# Altium schematic sheet [04] - OLD_Display & Pi Zero & USB Host.SchDoc
size A3; DocumentNumber: 2; SheetNumber: 2; SheetTotal: 4
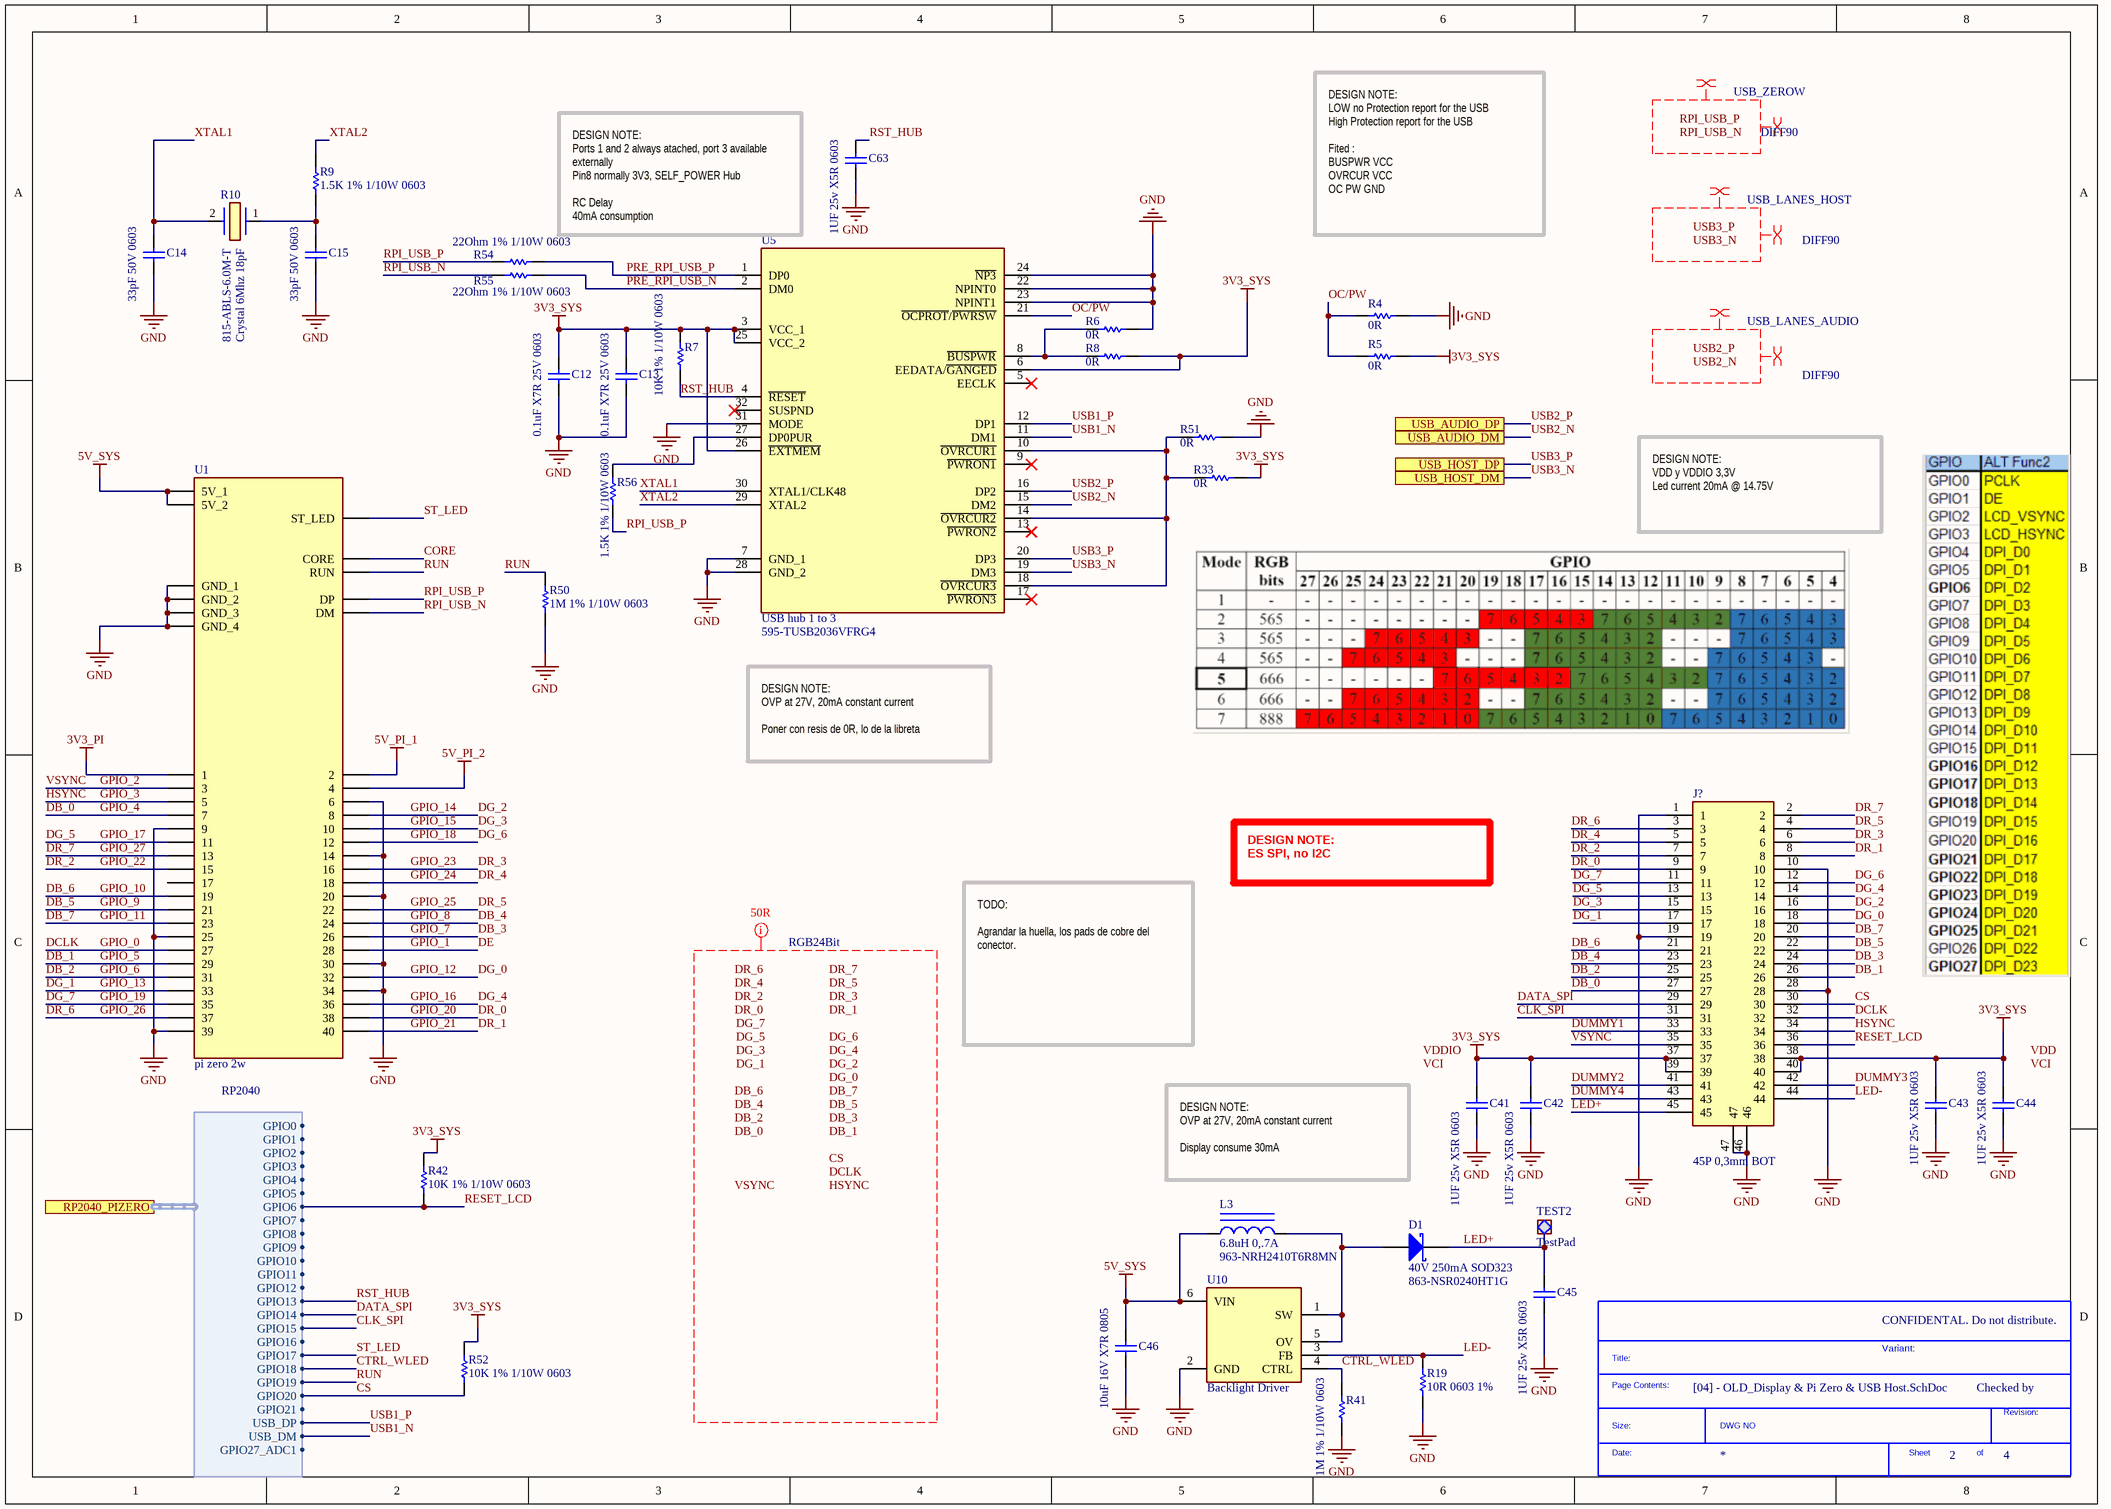
[diagram p0: [04] - OLD_Display & Pi Zero & USB Host.SchDoc]

## Parts
*  SDTitleBlock  (value not drawn)  (graphical)
C12  0.1uF X7R 25V 0603  [C 0603/1608]
C13  0.1uF X7R 25V 0603  [C 0603/1608]
C14  33pF 50V 0603  [C 0603/1608]
C15  33pF 50V 0603  [C 0603/1608]
C41  1UF 25v X5R 0603  [C 0603/1608]
C42  1UF 25v X5R 0603  [C 0603/1608]
C43  1UF 25v X5R 0603  [C 0603/1608]
C44  1UF 25v X5R 0603  [C 0603/1608]
C45  1UF 25v X5R 0603  [C 0603/1608]
C46  10uF 16V X7R 0805  [C 0805/2012]
C63  1UF 25v X5R 0603  [C 0603/1608]
D1  40V 250mA SOD323  Supplier Part Number 1: 863-NSR0240HT1G  [SOD-323]
J?  45P 0,3mm BOT  [FH26W45S03SHW60]
L3  6.8uH 0,.7A  Supplier Part Number 1: 963-NRH2410T6R8MN  [NRH2410T6R8MN]
R4  0R  [R 0603/1608]
R5  0R  [R 0603/1608]  (no BOM)
R6  0R  [R 0603/1608]  (no BOM)
R7  10K 1% 1/10W 0603  [R 0603/1608]
R8  0R  [R 0603/1608]
R9  1.5K 1% 1/10W 0603  [R 0603/1608]
R10  Crystal 6Mhz 18pF  Supplier Part Number 1: 815-ABLS-6.0M-T  [ABLS6000MHZB4T]
R19  10R 0603 1%  [R 0603/1608]
R33  0R  [R 0603/1608]
R41  1M 1% 1/10W 0603  [R 0603/1608]
R42  10K 1% 1/10W 0603  [R 0603/1608]
R50  1M 1% 1/10W 0603  [R 0603/1608]
R51  0R  [R 0603/1608]
R52  10K 1% 1/10W 0603  [R 0603/1608]
R54  22Ohm 1% 1/10W 0603  [R 0603/1608]
R55  22Ohm 1% 1/10W 0603  [R 0603/1608]
R56  1.5K 1% 1/10W 0603  [R 0603/1608]
TEST2  TestPad  [TestPad]  (no BOM)
U1  pi zero 2w  [Pi 2 Zero W]
U5  USB hub 1 to 3  Supplier Part Number 1: 595-TUSB2036VFRG4  [QFP80P900X900X160-32N]
U10  Backlight Driver  [SOT95P280X145-6N]

## Ports
RP2040_PIZERO (harness RP2040), USB_AUDIO_DM, USB_AUDIO_DP, USB_HOST_DM, USB_HOST_DP

## Harnesses
RP2040: GPIO0, GPIO1, GPIO2, GPIO3, USB_DP, USB_DM, GPIO27_ADC1, GPIO4, GPIO5, GPIO6, GPIO7, GPIO8, GPIO9, GPIO10, GPIO11, GPIO12, GPIO13, GPIO14, GPIO15, GPIO16, GPIO17, GPIO18, GPIO19, GPIO20, GPIO21

## Nets
3V3_PI: U1.1
3V3_SYS: C12.1 C13.1 C41.1 C42.1 C43.1 C44.1 J?.37 J?.38 J?.39 J?.40 R5.2 R7.2 R8.1 R33.1 R42.2 R52.2 U5.3(VCC_1) U5.6(EEDATA/~{GANGED}) U5.25(VCC_2) U5.26(~{EXTMEM})
5V_PI_1: U1.2
5V_PI_2: U1.4
5V_SYS: C46.2 L3.1 U1.5V_1 U1.5V_2 U10.6(VIN)
GND: C12.2 C13.2 C14.1 C15.2 C41.2 C42.2 C43.2 C44.2 C45.2 C46.1 C63.2 J?.1 J?.10 J?.19 J?.28 J?.46 J?.47 R4.2 R6.2 R19.1 R41.1 R50.1 R51.1 U1.6 U1.9 U1.14 U1.20 U1.25 U1.30 U1.34 U1.39 U1.GND_1 U1.GND_2 U1.GND_3 U1.GND_4 U5.7(GND_1) U5.22(NPINT0) U5.23(NPINT1) U5.24(~{NP3}) U5.28(GND_2) U5.31(MODE) U10.2(GND)
CLK_SPI: J?.31 ; port RP2040_PIZERO.GPIO15
CORE: U1.CORE
CS: J?.30 R52.1 ; port RP2040_PIZERO.GPIO20
CTRL_WLED: R41.2 U10.4(CTRL) ; port RP2040_PIZERO.GPIO18
DATA_SPI: J?.29 ; port RP2040_PIZERO.GPIO14
DB_0: J?.27 U1.7  [also labelled GPIO_4]
DB_1: J?.26 U1.29  [also labelled GPIO_5]
DB_2: J?.25 U1.31  [also labelled GPIO_6]
DB_3: J?.24 U1.26  [also labelled GPIO_7]
DB_4: J?.23 U1.24  [also labelled GPIO_8]
DB_5: J?.22 U1.21  [also labelled GPIO_9]
DB_6: J?.21 U1.19  [also labelled GPIO_10]
DB_7: J?.20 U1.23  [also labelled GPIO_11]
DCLK: J?.32 U1.27  [also labelled GPIO_0]
DE: U1.28  [also labelled GPIO_1]
DG_0: J?.18 U1.32  [also labelled GPIO_12]
DG_1: J?.17 U1.33  [also labelled GPIO_13]
DG_2: J?.16 U1.8  [also labelled GPIO_14]
DG_3: J?.15 U1.10  [also labelled GPIO_15]
DG_4: J?.14 U1.36  [also labelled GPIO_16]
DG_5: J?.13 U1.11  [also labelled GPIO_17]
DG_6: J?.12 U1.12  [also labelled GPIO_18]
DG_7: J?.11 U1.35  [also labelled GPIO_19]
DR_0: J?.9 U1.38  [also labelled GPIO_20]
DR_1: J?.8 U1.40  [also labelled GPIO_21]
DR_2: J?.7 U1.15  [also labelled GPIO_22]
DR_3: J?.6 U1.16  [also labelled GPIO_23]
DR_4: J?.5 U1.18  [also labelled GPIO_24]
DR_5: J?.4 U1.22  [also labelled GPIO_25]
DR_6: J?.3 U1.37  [also labelled GPIO_26]
DR_7: J?.2 U1.13  [also labelled GPIO_27]
DUMMY1: J?.33
DUMMY2: J?.41
DUMMY3: J?.42
DUMMY4: J?.43
GPIO_2: J?.35 U1.3  [also labelled VSYNC]
GPIO_3: J?.34 U1.5  [also labelled HSYNC]
LED+: C45.1 D1.1(K) J?.45 TEST2.1
LED-: J?.44 R19.2 U10.3(FB)
OC/PW: R4.1 R5.1 U5.21(~{OCPROT}/~{PWRSW})
PRE_RPI_USB_N: R55.2 U5.2(DM0)
PRE_RPI_USB_P: R54.2 U5.1(DP0)
RESET_LCD: J?.36 R42.1 ; port RP2040_PIZERO.GPIO6
RPI_USB_N: R55.1 U1.DM
RPI_USB_P: R54.1 R56.2 U1.DP
RST_HUB: C63.1 R7.1 U5.4(~{RESET}) ; port RP2040_PIZERO.GPIO13
RUN: R50.2 U1.RUN ; port RP2040_PIZERO.GPIO19
ST_LED: U1.ST_LED ; port RP2040_PIZERO.GPIO17
USB1_N: U5.11(DM1) ; port RP2040_PIZERO.USB_DM
USB1_P: U5.12(DP1) ; port RP2040_PIZERO.USB_DP
USB2_N: U5.15(DM2) ; port USB_AUDIO_DM
USB2_P: U5.16(DP2) ; port USB_AUDIO_DP
USB3_N: U5.19(DM3) ; port USB_HOST_DM
USB3_P: U5.20(DP3) ; port USB_HOST_DP
XTAL1: C14.2 R10.2(CRYSTAL_2) U5.30(XTAL1/CLK48)
XTAL2: R9.2 U5.29(XTAL2)
NetC15_1: C15.1 R9.1 R10.1
NetD1_2: D1.2(A) L3.2 U10.1(SW) U10.5(OV)
NetR6_1: R6.1 R8.2 U5.8(~{BUSPWR})
NetR33_2: R33.2 R51.2 U5.10(~{OVRCUR1}) U5.14(~{OVRCUR2}) U5.18(~{OVRCUR3})
NetR56_1: R56.1 U5.27(DP0PUR)

Not connected (* = marked no-connect by the designer): U1 17; U5 5(EECLK)* 9(~{PWRON1})* 13(~{PWRON2})* 17(~{PWRON3})* 32(SUSPND)*

## Layout directives
net class USB_LANES_HOST; rule Differential Pairs Routing [Pref Gap = 0.18mm    Min Gap  = 0.18mm    Max Gap  = 0.18mmPref Width = 0.15mm    Min Width  = 0.15mm    Max Width  = 0.15mm]: USB3_N, USB3_P
net class USB_LANES_AUDIO; rule Differential Pairs Routing [Pref Gap = 0.18mm    Min Gap  = 0.18mm    Max Gap  = 0.18mmPref Width = 0.15mm    Min Width  = 0.15mm    Max Width  = 0.15mm]: USB2_N, USB2_P
net class USB_ZEROW; rule Differential Pairs Routing [Pref Gap = 0.18mm    Min Gap  = 0.18mm    Max Gap  = 0.18mmPref Width = 0.15mm    Min Width  = 0.15mm    Max Width  = 0.15mm]: RPI_USB_N, RPI_USB_P
differential pair; net class DIFF90: RPI_USB_N, RPI_USB_P, USB2_N, USB2_P, USB3_N, USB3_P
net class RGB24Bit; rule Width Constraint [Pref Width = 0.18mm    Min Width = 0.18mm    Max Width = 0.18mm]: CS, DB_0, DB_1, DB_2, DB_3, DB_4, DB_5, DB_6, DB_7, DCLK, DG_0, DG_1, DG_2, DG_3, DG_4, DG_5, DG_6, DG_7, DR_0, DR_1, DR_2, DR_3, DR_4, DR_5, DR_6, DR_7, HSYNC, VSYNC

## Notes on the sheet
- DESIGN NOTE:
  Ports 1 and 2 always atached, port 3 available externally
  Pin8 normally 3V3, SELF_POWER Hub
  RC Delay
  40mA consumption
- DESIGN NOTE:
  LOW no Protection report for the USB
  High Protection report for the USB
  Fited :
  BUSPWR VCC
  OVRCUR VCC
  OC PW GND
- DESIGN NOTE:
  VDD y VDDIO 3,3V
  Led current 20mA @ 14.75V
- DESIGN NOTE:
  OVP at 27V, 20mA constant current
  Poner con resis de 0R, lo de la libreta
- DESIGN NOTE:
  ES SPI, no I2C
- TODO:
  Agrandar la huella, los pads de cobre del conector.
- DESIGN NOTE:
  OVP at 27V, 20mA constant current
  Display consume 30mA
- CONFIDENTAL. Do not distribute.
- Variant:
- Checked by
- Labels drawn without touching a wire or pin: CS, DB_0, DB_1, DB_2, DB_3, DB_4, DB_5, DB_6, DB_7, DCLK, DG_0, DG_1, DG_2, DG_3, DG_4, DG_5, DG_6, DG_7, DR_0, DR_1, DR_2, DR_3, DR_4, DR_5, DR_6, DR_7, HSYNC, RPI_USB_N, RPI_USB_P, USB2_N, USB2_P, USB3_N, USB3_P, VCI, VDD, VDDIO, VSYNC
- (in symbol SDTitleBlock) Title:; Page Contents:; Revision:; Size:; DWG NO; Date:; Sheet; of

## Library data of the parts
C12 C13 = 885012206071: WURTH ELEKTRONIK         885012206071             SMD Multilayer Ceramic Capacitor, 0603 [1608 Metric], 0.1 F, 25 V,  10%, X7R, WCAP-CSGP Series; Manufacturer: Wurth Electronics; Capacitance: 100nF; Supplier 1: Mouser; Manufacturer Part Number: 885012206071; Stock 1: 202580; Pricing 1: 1=0.1, 10=0.046, 50=0.046, 100=0.041, 1000=0.036, 10000=0.036 (USD); Mount: Surface Mount; Case/Package: 0603; Case Code (Metric): 1608; Case Code (Imperial): 0603; Min Operating Temperature: -55°C; Max Operating Temperature: 125°C; Packaging: Cut Tape; Voltage Rating: 25V; Dielectric: X7R; Tolerance: 10%; Voltage Rating (DC): 25V; Length: 0.063inch; Width: 0.031inch; Thickness: 0.037inch; REACH SVHC: Unknown; Supplier Part Number 1: 710-885012206071
C14 C15 = CC0603JRNPO9BN330: 0603 33 pF 50 V ±5 % Tolerance NP0 SMT Multilayer Ceramic Capacitor; Manufacturer: Yageo; Tolerance: 5%; Dielectric: C0G; Temperature Coefficient: 30ppm/°C; Insulation Resistance: 100GR; Supplier 1: Mouser; Manufacturer Part Number: CC0603JRNPO9BN330; RoHS: Yes; Category: Ceramic Capacitors; Stock 1: 62339; Pricing 1: 1=0,10000, 10=0,02400, 50=0,02400, 100=0,01900, 500=0,01700, 1000=0,01300, 4000=0,01000, 10000=0,01000 (USD); Mount: Surface Mount; Case/Package: 0603; Number of Pins: 2; Case Code (Metric): 1608; Case Code (Imperial): 0603; Dielectric Material: Ceramic; Min Operating Temperature: -55°C; Max Operating Temperature: 125°C; Capacitance: 33pF; Packaging: Tape and Reel; Voltage Rating: 50V; Package Quantity: 1; Voltage Rating (DC): 50V; Termination: SMD/SMT; Resistor Type: Ceramic; Voltage: 50V; Series: CC; Length: 1.6mm; Width: 0.031inch; Height: 0.8mm; Thickness: 0.035inch; Depth: 0.8mm; Radiation Hardening: No; REACH SVHC: No SVHC; Lead Free: Lead Free; RoHS Compliant: Yes; ComponentLink1URL: https://datasheet.ciiva.com/11786/0900766b8079c870-11786082.pdf?src-supplier=RSComponents; ComponentLink1Description: https://datasheet.ciiva.com/11786/0900766b8079c870-11786082.pdf?src-supplier=RSComponents; ComponentLink2URL: https://datasheet.ciiva.com/26862/getdatasheetpartid-403532-26862767.pdf?src-supplier=Verical; ComponentLink2Description: https://datasheet.ciiva.com/26862/getdatasheetpartid-403532-26862767.pdf?src-supplier=Verical; ComponentLink3URL: https://datasheet.ciiva.com/8033/1443161-8033735.pdf?src-supplier=Element14; ComponentLink3Description: https://datasheet.ciiva.com/8033/1443161-8033735.pdf?src-supplier=Element14; ComponentLink4URL: https://datasheet.ciiva.com/7978/1443161-7978142.pdf?src-supplier=Element14; ComponentLink4Description: https://datasheet.ciiva.com/7978/1443161-7978142.pdf?src-supplier=Element14; ComponentLink5URL: https://datasheet.ciiva.com/46430/1835847-46430155.pdf?src-supplier=Element14; ComponentLink5Description: https://datasheet.ciiva.com/46430/1835847-46430155.pdf?src-supplier=Element14; ComponentLink6URL: https://datasheet.ciiva.com/144/mlccorderingcode-144644.pdf?src-supplier=Digi-Key; ComponentLink6Description: https://datasheet.ciiva.com/144/mlccorderingcode-144644.pdf?src-supplier=Digi-Key; ComponentLink7URL: https://datasheet.ciiva.com/144/mlccorderingcode-144643.pdf?src-supplier=Digi-Key; ComponentLink7Description: https://datasheet.ciiva.com/144/mlccorderingcode-144643.pdf?src-supplier=Digi-Key; ComponentLink8URL: https://datasheet.ciiva.com/144/mlccorderingcode-144645.pdf?src-supplier=Digi-Key; ComponentLink8Description: https://datasheet.ciiva.com/144/mlccorderingcode-144645.pdf?src-supplier=Digi-Key; ComponentLink9URL: https://datasheet.ciiva.com/5426/upy-gp-np0-16v-to-50v-8-5426614.pdf?src-supplier=Mouser; ComponentLink9Description: https://datasheet.ciiva.com/5426/upy-gp-np0-16v-to-50v-8-5426614.pdf?src-supplier=Mouser; ComponentLink10URL: https://datasheet.ciiva.com/8033/1372269-8033734.pdf?src-supplier=Element14; ComponentLink10Description: https://datasheet.ciiva.com/8033/1372269-8033734.pdf?src-supplier=Element14; ComponentLink11URL: https://datasheet.ciiva.com/11464/upy-gp-np0-16v-to-50v-8-11464730.pdf?src-supplier=Avnet; ComponentLink11Description: https://datasheet.ciiva.com/11464/upy-gp-np0-16v-to-50v-8-11464730.pdf?src-supplier=Avnet; Supplier Part Number 1: 603-C0603JRNPO9BN330
C41-C45 C63 = CC0603KRX5R8BB105: CAP CER 1UF 25V X5R 0603; Manufacturer: Yageo; Tolerance: 10%; Supplier 1: Mouser; Manufacturer Part Number: CC0603KRX5R8BB105; RoHS: Yes; Stock 1: 9567246; Pricing 1: 1 = 0,10000, 10 = 0,04700, 50 = 0,04700, 100 = 0,01700, 1000 = 0,01600, 10000 = 0,00800 (USD); Mount: Surface Mount; Case/Package: 0603; Number of Pins: 2; Case Code (Metric): 1608; Case Code (Imperial): 0603; Min Operating Temperature: -55°C; Max Operating Temperature: 85°C; Package Quantity: 1; Capacitance: 1uF; Voltage Rating: 25V; Packaging: Tape and Reel; Dielectric: X5R; Termination: SMD/SMT; Voltage Rating (DC): 25V; Length: 1.6mm; Height: 0.8mm; Width: 0.031inch; Thickness: 0.035inch; Depth: 0.8mm; Radiation Hardening: No; REACH SVHC: No SVHC; Lead Free: Lead Free; Halogen Free: Halogen Free; ComponentLink1URL: https://datasheet.ciiva.com/176/mlccorderingcode-176785.pdf?src-supplier=Digi-Key; ComponentLink1Description: https://datasheet.ciiva.com/176/mlccorderingcode-176785.pdf?src-supplier=Digi-Key; ComponentLink2URL: https://datasheet.ciiva.com/176/mlccorderingcode-176786.pdf?src-supplier=Digi-Key; ComponentLink2Description: https://datasheet.ciiva.com/176/mlccorderingcode-176786.pdf?src-supplier=Digi-Key; ComponentLink3URL: https://datasheet.ciiva.com/176/mlccorderingcode-176787.pdf?src-supplier=Digi-Key; ComponentLink3Description: https://datasheet.ciiva.com/176/mlccorderingcode-176787.pdf?src-supplier=Digi-Key; ComponentLink4URL: https://datasheet.ciiva.com/17436/upy-gphc-x5r-4v-to-50v-12-17436952.pdf?src-supplier=Avnet+Europe; ComponentLink4Description: https://datasheet.ciiva.com/17436/upy-gphc-x5r-4v-to-50v-12-17436952.pdf?src-supplier=Avnet+Europe; ComponentLink5URL: https://datasheet.ciiva.com/7978/1525783-7978171.pdf?src-supplier=Element14; ComponentLink5Description: https://datasheet.ciiva.com/7978/1525783-7978171.pdf?src-supplier=Element14; ComponentLink6URL: https://datasheet.ciiva.com/11586/upy-gphc-x5r-4v-to-50v-12-11586318.pdf?src-supplier=Avnet; ComponentLink6Description: https://datasheet.ciiva.com/11586/upy-gphc-x5r-4v-to-50v-12-11586318.pdf?src-supplier=Avnet; Supplier Part Number 1: 603-CC603KRX5R8BB105
C46 = CL21B106KOQNNNE: CAP CER 10UF 16V X7R 0805; Manufacturer: Samsung Electro-Mechanics; Tolerance: ±10%; Notification: Current market demand for these product types have resulted in fluctuating and extending lead times. Lead times may differ.; Supplier 1: Digi-Key; Manufacturer Part Number: CL21B106KOQNNNE; RoHS: RoHS Compliant; Category: Capacitors; Stock 1: 20000; Pricing 1: 1=0.24, 10=0.163, 100=0.0923, 500=0.06514, 1000=0.057 (GBP); Packaging: Cut Tape (CT); Part Status: Active; Voltage - Rated: 16V; Temperature Coefficient: X7R; Operating Temperature: -55°C ~ 125°C; Features: -; Ratings: -; Applications: General Purpose; Mounting Type: Surface Mount, MLCC; Package / Case: 0805 (2012 Metric); Size / Dimension: 0.079" L x 0.049" W (2.00mm x 1.25mm); Height - Seated (Max): -; Thickness (Max): 0.055" (1.40mm); Lead Spacing: -; Lead Style: -; ComponentLink1URL: http://www.samsungsem.com/kr/support/product-search/mlcc/CL21B106KOQNNNE.jsp; ComponentLink1Description: http://www.samsungsem.com/kr/support/product-search/mlcc/CL21B106KOQNNNE.jsp; Supplier Part Number 1: 1276-2872-1-ND
D1 = NSR0240HT1G: DIODE SCHOTTKY 40V 250MA SOD323; Manufacturer: ON Semiconductor; Max Surge Current: 1A; Recovery Time: 3ns; Peak Reverse Current: 10uA; Forward Voltage: 710mV; Power Dissipation: 270mW; Element Configuration: Single; Supplier 1: Mouser; Manufacturer Part Number: NSR0240HT1G; RoHS: Yes; Stock 1: 30582; Pricing 1: 1 = 0,23000, 10 = 0,15400, 50 = 0,15400, 100 = 0,06500, 1000 = 0,04400, 10000 = 0,03000 (USD); Case/Package: SOD-323-2; Number of Pins: 2; Contact Plating: Tin; Min Operating Temperature: -55°C; Max Operating Temperature: 150°C; Package Quantity: 1; Forward Current: 250mA; Packaging: Tape and Reel; Max Reverse Leakage Current: 10uA; Average Rectified Current: 250mA; Reverse Recovery Time: 3ns; Max Repetitive Reverse Voltage (Vrrm): 40V; Peak Non-Repetitive Surge Current: 1A; Max Forward Surge Current (Ifsm): 1A; Max Reverse Voltage (DC): 40V; Length: 1.8mm; Height: 1mm; Width: 1.35mm; Radiation Hardening: No; REACH SVHC: No SVHC; Lead Free: Lead Free; ComponentLink1URL: https://datasheet.ciiva.com/4714/nsr0240h-d-113658-4714368.pdf?src-supplier=Mouser; ComponentLink1Description: https://datasheet.ciiva.com/4714/nsr0240h-d-113658-4714368.pdf?src-supplier=Mouser; ComponentLink2URL: https://datasheet.ciiva.com/8293/nsr0240h-d-8293840.pdf?src-supplier=Avnet; ComponentLink2Description: https://datasheet.ciiva.com/8293/nsr0240h-d-8293840.pdf?src-supplier=Avnet; ComponentLink3URL: https://datasheet.ciiva.com/25949/nsr0240h-d-25949637.pdf?src-supplier=Avnet+Europe; ComponentLink3Description: https://datasheet.ciiva.com/25949/nsr0240h-d-25949637.pdf?src-supplier=Avnet+Europe; ComponentLink4URL: https://datasheet.ciiva.com/915/nsr0240h-d-915416.pdf?src-supplier=Digi-Key; ComponentLink4Description: https://datasheet.ciiva.com/915/nsr0240h-d-915416.pdf?src-supplier=Digi-Key; ComponentLink5URL: https://datasheet.ciiva.com/915/nsr0240h-d-915417.pdf?src-supplier=Digi-Key; ComponentLink5Description: https://datasheet.ciiva.com/915/nsr0240h-d-915417.pdf?src-supplier=Digi-Key; ComponentLink6URL: https://datasheet.ciiva.com/16396/nsr0240h-d-16396521.pdf?src-supplier=Future+Electronics; ComponentLink6Description: https://datasheet.ciiva.com/16396/nsr0240h-d-16396521.pdf?src-supplier=Future+Electronics; ComponentLink7URL: https://datasheet.ciiva.com/915/nsr0240h-d-915418.pdf?src-supplier=Digi-Key; ComponentLink7Description: https://datasheet.ciiva.com/915/nsr0240h-d-915418.pdf?src-supplier=Digi-Key; ComponentLink8URL: https://datasheet.ciiva.com/7963/nsr0240h-d-7963165.pdf?src-supplier=Element14; ComponentLink8Description: https://datasheet.ciiva.com/7963/nsr0240h-d-7963165.pdf?src-supplier=Element14
J? = FH26W-45S-0.3SHW(60): FFC FPC Connectors Horizontal Mounting Angle Light Brown 0.3 mm - Pitch 45 Positions; Manufacturer: Hirose; Supplier 1: Mouser; Manufacturer Part Number: FH26W-45S-0.3SHW(60); RoHS: Yes; Category: FFC / FPC; Stock 1: 44650; Pricing 1: 1=2,29000, 10=1,92000, 50=1,92000, 100=1,79000, 1000=1,28000, 10000=1,13000 (USD); ComponentLink1URL: http://www.farnell.com/datasheets/2691081.pdf?src-supplier=Farnell; ComponentLink1Description: http://www.farnell.com/datasheets/2691081.pdf?src-supplier=Farnell; ComponentLink2URL: https://www.hirose.com/product/document?clcode=CL0580-2401-1-60&amp;productname=FH26W-13S-0.3SHW(60)&amp;series=FH26&amp;documenttype=Catalog&amp;lang=en&amp;documentid=D49355_en&src-supplier=Digi-Key; ComponentLink2Description: https://www.hirose.com/product/document?clcode=CL0580-2401-1-60&amp;productname=FH26W-13S-0.3SHW(60)&amp;series=FH26&amp;documenttype=Catalog&amp;lang=en&amp;documentid=D49355_en&src-supplier=Digi-Key; ComponentLink3URL: https://www.hirose.com/product/en/download_file/key_name/FH26W-61S-0.3SHW%2860%29/category/Drawing%20(2D)/doc_file_id/43329/?file_category_id=6&item_id=05802418460&is_series=&src-supplier=Digi-Key; ComponentLink3Description: https://www.hirose.com/product/en/download_file/key_name/FH26W-61S-0.3SHW%2860%29/category/Drawing%20(2D)/doc_file_id/43329/?file_category_id=6&item_id=05802418460&is_series=&src-supplier=Digi-Key; ComponentLink4URL: https://www.hirose.com/product/en/download_file/key_name/FH26/category/Catalog/doc_file_id/49355/?file_category_id=4&item_id=298&is_series=1&src-supplier=Digi-Key; ComponentLink4Description: https://www.hirose.com/product/en/download_file/key_name/FH26/category/Catalog/doc_file_id/49355/?file_category_id=4&item_id=298&is_series=1&src-supplier=Digi-Key; Supplier Part Number 1: 798-FH26W45S03SHW60
L3 = NRH2410T6R8MN: Inductor Power Shielded Wirewound 6.8uH 20% 100KHz Ferrite 0.57A 0.492Ohm DCR T/R; Manufacturer: Taiyo Yuden; Current Rating: 570mA; Saturation Current: 750mA; Self Resonant Frequency: 43MHz; DC Resistance (DCR): 492mR; Supplier 1: Mouser; Manufacturer Part Number: NRH2410T6R8MN; RoHS: Yes; Category: Fixed Inductors; Stock 1: 34335; Pricing 1: 1=0,23000, 10=0,15400, 50=0,15400, 100=0,12400, 1000=0,09100, 10000=0,06800 (USD); Mount: Surface Mount; Case/Package: Nonstandard; Number of Pins: 2; Core Material: Ferrite; Min Operating Temperature: -25°C; Max Operating Temperature: 120°C; Tolerance: 20%; Shielding: Shielded; Packaging: Tape and Reel; Inductance: 6.8uH; Resistor Type: Wirewound; Test Frequency: 100kHz; Package Quantity: 2500; Inductance Tolerance: 20%; Max DC Current: 750mA; Termination: SMD/SMT; Series: NRH; Length: 2.4mm; Width: 0.094inch; Height: 1mm; Height - Seated (Max): 0.039inch; Lead Pitch: 1.45mm; Depth: 2.5mm; Radiation Hardening: No; RoHS Compliant: Yes; REACH SVHC: No SVHC; Halogen Free: Halogen Free; ComponentLink1URL: https://datasheet.ciiva.com/1043/nrh2410t6r8mn-ss-1043809.pdf?src-supplier=Digi-Key; ComponentLink1Description: https://datasheet.ciiva.com/1043/nrh2410t6r8mn-ss-1043809.pdf?src-supplier=Digi-Key; ComponentLink2URL: https://datasheet.ciiva.com/8502/nrh2410t6r8mn-ss-8502817.pdf?src-supplier=Avnet; ComponentLink2Description: https://datasheet.ciiva.com/8502/nrh2410t6r8mn-ss-8502817.pdf?src-supplier=Avnet; ComponentLink3URL: https://datasheet.ciiva.com/25606/0900766b810b3cd2-25606903.pdf?src-supplier=RSComponents; ComponentLink3Description: https://datasheet.ciiva.com/25606/0900766b810b3cd2-25606903.pdf?src-supplier=RSComponents
R4-R6 R8 R33 R51 = RC0603JR-070RL: RES SMD 0 OHM JUMPER 1/10W 0603; Manufacturer: Yageo; Resistance: 0mR; Tolerance: 1%; Power Rating: 100mW; Voltage Rating (DC): 50V; Temperature Coefficient: 200ppm/°C; Supplier 1: Mouser; Manufacturer Part Number: RC0603JR-070RL; RoHS: Yes; Stock 1: 11022274; Pricing 1: 1 = 0,10000, 10 = 0,01500, 50 = 0,01500, 100 = 0,00500, 1000 = 0,00400, 10000 = 0,00400 (USD); Case/Package: 0603; Number of Pins: 2; Contact Plating: Tin; Case Code (Imperial): 0603; Case Code (Metric): 1608; Min Operating Temperature: -55°C; Max Operating Temperature: 155°C; Composition: Thick Film; Packaging: Tape and Reel; Termination: SMD/SMT; Package Quantity: 5000; Voltage Rating: 50V; Military Standard: Not; Length: 1.6mm; Height: 0.45mm; Width: 0.8mm; Depth: 0.8mm; Radiation Hardening: No; REACH SVHC: No SVHC; Lead Free: Lead Free; ComponentLink1URL: https://datasheet.ciiva.com/11808/pyu-r-int-6-11808700.pdf?src-supplier=RSComponents; ComponentLink1Description: https://datasheet.ciiva.com/11808/pyu-r-int-6-11808700.pdf?src-supplier=RSComponents; ComponentLink2URL: https://datasheet.ciiva.com/7746/1738695-7746421.pdf?src-supplier=Element14; ComponentLink2Description: https://datasheet.ciiva.com/7746/1738695-7746421.pdf?src-supplier=Element14; ComponentLink3URL: https://datasheet.ciiva.com/8883/pyu-rc0603-51-rohs-l-4-8883045.pdf?src-supplier=Avnet; ComponentLink3Description: https://datasheet.ciiva.com/8883/pyu-rc0603-51-rohs-l-4-8883045.pdf?src-supplier=Avnet; ComponentLink4URL: https://datasheet.ciiva.com/15189/getdatasheetpartid-329462-15189845.pdf?src-supplier=Verical; ComponentLink4Description: https://datasheet.ciiva.com/15189/getdatasheetpartid-329462-15189845.pdf?src-supplier=Verical; ComponentLink5URL: https://datasheet.ciiva.com/7746/1738695-7746422.pdf?src-supplier=Element14; ComponentLink5Description: https://datasheet.ciiva.com/7746/1738695-7746422.pdf?src-supplier=Element14; ComponentLink6URL: https://datasheet.ciiva.com/12555/rc0603-272842-12555254.pdf?src-supplier=Mouser; ComponentLink6Description: https://datasheet.ciiva.com/12555/rc0603-272842-12555254.pdf?src-supplier=Mouser; ComponentLink7URL: https://datasheet.ciiva.com/22747/443971-22747530.pdf?src-supplier=Element14; ComponentLink7Description: https://datasheet.ciiva.com/22747/443971-22747530.pdf?src-supplier=Element14; Supplier Part Number 1: 603-RC0603JR-070RL
R7 R42 R52 = RC0603FR-0710KL: RES SMD 10K OHM 1% 1/10W 0603; Manufacturer: Yageo; Power (Watts): 0.1W, 1/10W; Temperature Coefficient: ±100ppm/°C; Supplier 1: Digi-Key; Manufacturer Part Number: RC0603FR-0710KL; RoHS: RoHS Compliant; Category: Resistors; Stock 1: 47851285; Pricing 1: 1=0.08, 10=0.013, 100=0.005, 1000=0.00224, 2500=0.00195 (EUR); Packaging: Cut Tape (CT); Part Status: Active; Tolerance: ±1%; Composition: Thick Film; Features: Moisture Resistant; Operating Temperature: -55°C ~ 155°C; Package / Case: 0603 (1608 Metric); Supplier Device Package: 0603; Size / Dimension: 0.063" L x 0.032" W (1.60mm x 0.80mm); Height - Seated (Max): 0.022" (0.55mm); Failure Rate: -; ComponentLink1URL: http://www.yageo.com/documents/recent/PYu-RC_Group_51_RoHS_L_8.pdf; ComponentLink1Description: http://www.yageo.com/documents/recent/PYu-RC_Group_51_RoHS_L_8.pdf; Supplier Part Number 1: 311-10.0KHRCT-ND
R9 R56 = RC0603FR-071K5L: RES SMD 1.5K OHM 1% 1/10W 0603; Manufacturer: Yageo; Resistance: 1.5kR; Temperature Coefficient: 100ppm/°C; Voltage Rating (DC): 50V; Power Rating: 100mW; Supplier 1: Mouser; Manufacturer Part Number: RC0603FR-071K5L; RoHS: Yes; Stock 1: 1280962; Pricing 1: 1 = 0,10000, 10 = 0,01800, 50 = 0,01800, 100 = 0,00600, 1000 = 0,00500, 10000 = 0,00300 (USD); Case/Package: 0603; Number of Pins: 2; Case Code (Metric): 1608; Case Code (Imperial): 0603; Min Operating Temperature: -55°C; Max Operating Temperature: 155°C; Tolerance: 1%; Packaging: Tape and Reel; Composition: Thick Film; Voltage Rating: 50V; Package Quantity: 1; Number of Terminations: 2; Termination: SMD/SMT; Military Standard: Not; Max Power Dissipation: 100mW; Features: Moisture Resistant; Length: 0.063inch; Height: 0.022inch; Width: 0.031inch; Depth: 0.8mm; REACH SVHC: No SVHC; Lead Free: Lead Free; ComponentLink1URL: https://datasheet.ciiva.com/2454/pyu-r-int-thick-7-2454513.pdf?src-supplier=Digi-Key; ComponentLink1Description: https://datasheet.ciiva.com/2454/pyu-r-int-thick-7-2454513.pdf?src-supplier=Digi-Key; ComponentLink2URL: https://datasheet.ciiva.com/2454/pyu-r-int-thick-7-2454514.pdf?src-supplier=Digi-Key; ComponentLink2Description: https://datasheet.ciiva.com/2454/pyu-r-int-thick-7-2454514.pdf?src-supplier=Digi-Key; ComponentLink3URL: https://datasheet.ciiva.com/2454/pyu-r-int-thick-7-2454515.pdf?src-supplier=Digi-Key; ComponentLink3Description: https://datasheet.ciiva.com/2454/pyu-r-int-thick-7-2454515.pdf?src-supplier=Digi-Key; ComponentLink4URL: https://datasheet.ciiva.com/46440/1868787-46440895.pdf?src-supplier=Element14; ComponentLink4Description: https://datasheet.ciiva.com/46440/1868787-46440895.pdf?src-supplier=Element14; Supplier Part Number 1: 603-RC0603FR-071K5L
R10 = ABLS-6.000MHZ-B4-T: Crystal 6MHz ±30ppm (Tol) ±50ppm (Stability) 18pF FUND 100Ohm 2-Pin HC-49/US SMD T/R; Manufacturer: Abracon; ESR (Equivalent Series Resistance): 100R; Supplier 1: Mouser; Manufacturer Part Number: ABLS-6.000MHZ-B4-T; RoHS: Yes; Category: Crystals; Stock 1: 4366; Pricing 1: 1=0,29000, 10=0,23800, 50=0,23800, 100=0,19200, 1000=0,15600, 10000=0,14200 (USD); Mount: Surface Mount; Case/Package: SMD/SMT; Min Operating Temperature: -20°C; Max Operating Temperature: 70°C; Frequency: 6MHz; Load Capacitance: 18pF; Packaging: Tape and Reel; Package Quantity: 1000; Tolerance: 30ppm; Frequency Tolerance: 30ppm; Frequency Stability: 50ppm; Termination: SMD/SMT; Series Resistance: 100R; Length: 11.4mm; Width: 4.7mm; Height: 0.165inch; Depth: 4.7mm; Radiation Hardening: No; REACH SVHC: Yes; Lead Free: Lead Free; ComponentLink1URL: https://datasheet.ciiva.com/15116/getdatasheetpartid-722413-15116851.pdf?src-supplier=Verical; ComponentLink1Description: https://datasheet.ciiva.com/15116/getdatasheetpartid-722413-15116851.pdf?src-supplier=Verical; ComponentLink2URL: https://datasheet.ciiva.com/16378/abls-16378057.pdf?src-supplier=Future+Electronics; ComponentLink2Description: https://datasheet.ciiva.com/16378/abls-16378057.pdf?src-supplier=Future+Electronics; ComponentLink3URL: https://datasheet.ciiva.com/854/abls-854139.pdf?src-supplier=Digi-Key; ComponentLink3Description: https://datasheet.ciiva.com/854/abls-854139.pdf?src-supplier=Digi-Key; ComponentLink4URL: https://datasheet.ciiva.com/854/abls-854140.pdf?src-supplier=Digi-Key; ComponentLink4Description: https://datasheet.ciiva.com/854/abls-854140.pdf?src-supplier=Digi-Key; ComponentLink5URL: https://datasheet.ciiva.com/854/abls-854138.pdf?src-supplier=Digi-Key; ComponentLink5Description: https://datasheet.ciiva.com/854/abls-854138.pdf?src-supplier=Digi-Key; ComponentLink6URL: https://datasheet.ciiva.com/3175/abls-3175436.pdf?src-supplier=Avnet; ComponentLink6Description: https://datasheet.ciiva.com/3175/abls-3175436.pdf?src-supplier=Avnet
R19 = RT0603FRE0710RL: High Precision-High Stability Chip Resistor Thin Film 0603 10Ohm 1% Paper T/R; Manufacturer: Yageo; Power Rating: 100mW; Voltage Rating: 75V; Temperature Coefficient: 50ppm/°C; Supplier 1: Mouser; Manufacturer Part Number: RT0603FRE0710RL; RoHS: Yes; Category: Chip SMD Resistors; Stock 1: 38412; Pricing 1: 1=0,10000, 10=0,06200, 50=0,06200, 100=0,02500, 1000=0,01200, 10000=0,00800 (USD); Case/Package: 0603; Number of Pins: 2; Case Code (Metric): 1608; Case Code (Imperial): 0603; Contact Plating: Tin,Lead; Min Operating Temperature: -55°C; Max Operating Temperature: 125°C; Tolerance: 1%; Resistance: 10R; Packaging: Tape and Reel; Package Quantity: 5000; Resistor Type: Thin Film; Number of Terminations: 2; Termination: SMD/SMT; Max Power Dissipation: 100mW; Voltage Rating (DC): 75V; Features: Moisture Resistant; Series: RT; Construction: Rectangular; Resistance Tolerance: 1%; Length: 1.6mm; Width: 0.031inch; Height: 0.022inch; Depth: 0.8mm; REACH SVHC: Unknown; Military Standard: Not; Lead Free: Lead Free; RoHS Compliant: Yes; ComponentLink1URL: https://datasheet.ciiva.com/12834/pyu-rt-1-to-0-05-rohs-l-4-12834894.pdf?src-supplier=Mouser; ComponentLink1Description: https://datasheet.ciiva.com/12834/pyu-rt-1-to-0-05-rohs-l-4-12834894.pdf?src-supplier=Mouser; ComponentLink2URL: https://datasheet.ciiva.com/2559/pyu-rt-1-to-0-05-rohs-l-5-2559486.pdf?src-supplier=Digi-Key; ComponentLink2Description: https://datasheet.ciiva.com/2559/pyu-rt-1-to-0-05-rohs-l-5-2559486.pdf?src-supplier=Digi-Key; Supplier Part Number 1: 603-RT0603FRE0710RL
R41 R50 = RC0603FR-071ML: RES SMD 1M OHM 1% 1/10W 0603; Manufacturer 1: Yageo; Voltage Rating: 50V; Resistance: 1MR; Power Rating: 100mW; Temperature Coefficient: 100ppm/°C; Supplier 1: Digi-Key; Manufacturer Part Number 1: RC0603FR-071ML; Stock 1: 9751331; Pricing 1: 1=0,10000, 10=0,02400, 100=0,00970, 1000=0,00437, 2500=0,00379 (USD); RoHS: Yes; Case/Package: 0603; Number of Pins: 2; Case Code (Imperial): 0603; Case Code (Metric): 1608; Min Operating Temperature: -55°C; Max Operating Temperature: 155°C; Voltage Rating (DC): 50V; Tolerance: 1%; Packaging: Tape and Reel; Package Quantity: 5000; Termination: SMD/SMT; Composition: Thick Film; Military Standard: Not; Length: 1.6mm; Height: 0.45mm; Width: 0.8mm; Depth: 0.8mm; REACH SVHC: No SVHC; Lead Free: Lead Free; ComponentLink1URL: https://datasheet.ciiva.com/11819/0900766b80f96399-11819295.pdf?src-supplier=RSComponents; ComponentLink1Description: https://datasheet.ciiva.com/11819/0900766b80f96399-11819295.pdf?src-supplier=RSComponents; ComponentLink2URL: https://datasheet.ciiva.com/7983/443971-7983614.pdf?src-supplier=Element14; ComponentLink2Description: https://datasheet.ciiva.com/7983/443971-7983614.pdf?src-supplier=Element14; ComponentLink3URL: https://datasheet.ciiva.com/12555/rc0603-272842-12555388.pdf?src-supplier=Mouser; ComponentLink3Description: https://datasheet.ciiva.com/12555/rc0603-272842-12555388.pdf?src-supplier=Mouser; Supplier Part Number 1: 311-1.00MHRDKR-ND
R54 R55 = RC0603FR-0722RL: RES SMD 22 OHM 1% 1/10W 0603; Manufacturer: Yageo; Resistance: 22R; Temperature Coefficient: 100ppm/°C; Voltage Rating (DC): 50V; Power Rating: 100mW; Supplier 1: Mouser; Manufacturer Part Number: RC0603FR-0722RL; RoHS: Yes; Stock 1: 1162810; Pricing 1: 1 = 0,10000, 10 = 0,01800, 50 = 0,01800, 100 = 0,00600, 1000 = 0,00500, 10000 = 0,00300 (USD); Case/Package: 0603; Number of Pins: 2; Case Code (Metric): 1608; Case Code (Imperial): 0603; Min Operating Temperature: -55°C; Max Operating Temperature: 155°C; Tolerance: 1%; Composition: Thick Film; Packaging: Tape and Reel; Voltage Rating: 50V; Package Quantity: 1; Number of Terminations: 2; Termination: SMD/SMT; Military Standard: Not; Max Power Dissipation: 100mW; Features: Moisture Resistant; Length: 1.6mm; Height: 0.022inch; Width: 0.031inch; Depth: 0.8mm; REACH SVHC: No SVHC; Lead Free: Lead Free; ComponentLink1URL: https://datasheet.ciiva.com/11819/0900766b80f96399-11819285.pdf?src-supplier=RSComponents; ComponentLink1Description: https://datasheet.ciiva.com/11819/0900766b80f96399-11819285.pdf?src-supplier=RSComponents; ComponentLink2URL: https://datasheet.ciiva.com/2454/pyu-r-int-thick-7-2454354.pdf?src-supplier=Digi-Key; ComponentLink2Description: https://datasheet.ciiva.com/2454/pyu-r-int-thick-7-2454354.pdf?src-supplier=Digi-Key; ComponentLink3URL: https://datasheet.ciiva.com/2454/pyu-r-int-thick-7-2454355.pdf?src-supplier=Digi-Key; ComponentLink3Description: https://datasheet.ciiva.com/2454/pyu-r-int-thick-7-2454355.pdf?src-supplier=Digi-Key; ComponentLink4URL: https://datasheet.ciiva.com/2454/pyu-r-int-thick-7-2454356.pdf?src-supplier=Digi-Key; ComponentLink4Description: https://datasheet.ciiva.com/2454/pyu-r-int-thick-7-2454356.pdf?src-supplier=Digi-Key; ComponentLink5URL: https://datasheet.ciiva.com/46440/1868787-46440901.pdf?src-supplier=Element14; ComponentLink5Description: https://datasheet.ciiva.com/46440/1868787-46440901.pdf?src-supplier=Element14; ComponentLink6URL: https://datasheet.ciiva.com/46395/443971-46395032.pdf?src-supplier=Element14; ComponentLink6Description: https://datasheet.ciiva.com/46395/443971-46395032.pdf?src-supplier=Element14; Supplier Part Number 1: 603-RC0603FR-0722RL
TEST2 = PP_SMT_ROUND_2MM: Probe Pad, SMT, ROUND, 2.0MM
U1 = PI ZERO 2W: Comprar los pogo 575-906015  x 60 y los de los tornillos x4 710-9774025151R
U5 = TUSB2036VFRG4: 2/3-port 12-Mbps USB full-speed hub with optional serial EEPROM interface 32-LQFP 0 to 70; Manufacturer: Texas Instruments; Data Rate: 12Mbps; Operating Supply Voltage: 3.3V; Operating Supply Current: 40mA; Number of Ports: 3; Number of Transceivers: 4; Supplier 1: Mouser; Manufacturer Part Number: TUSB2036VFRG4; RoHS: Yes; Category: Interface ICs; Stock 1: 2568; Pricing 1: 1=3,59000, 10=3,22000, 25=3,05000, 50=3,05000, 100=2,64000, 250=2,51000, 500=2,25000, 1000=1,96000, 10000=1,96000 (USD); Case/Package: LQFP; Number of Pins: 32; Weight: 0.006148oz; Min Operating Temperature: 0°C; Max Operating Temperature: 70°C; Packaging: Tape and Reel; Package Quantity: 1000; Series: -; Length: 7mm; Width: 7mm; Height: 1.4mm; Radiation Hardening: No; Lead Free: Lead Free; RoHS Compliant: Yes; ComponentLink1URL: https://datasheet.ciiva.com/4787/slls372e-121892-4787764.pdf?src-supplier=Mouser; ComponentLink1Description: https://datasheet.ciiva.com/4787/slls372e-121892-4787764.pdf?src-supplier=Mouser; ComponentLink2URL: https://datasheet.ciiva.com/1696/tusb2036-1696899.pdf?src-supplier=Digi-Key; ComponentLink2Description: https://datasheet.ciiva.com/1696/tusb2036-1696899.pdf?src-supplier=Digi-Key
U10 = AP3032KTR-G1: AP3032 Series 9 V 1.3 MHz Surface Mount White LED Step-Up Converter - SOT-23-6; Manufacturer: Diodes; Number of Outputs: 1; Frequency: 1MHz; Max Supply Voltage: 9V; Output Current per Channel: 1.4A; Min Input Voltage: 2.7V; Max Output Voltage: 38V; Switching Frequency: 750kHz; Topology: Boost; Dimming: PWM; Supplier 1: Mouser; Manufacturer Part Number: AP3032KTR-G1; RoHS: Yes; Category: LED Drivers; Stock 1: 35875; Pricing 1: 1=0,41000, 10=0,33600, 50=0,33600, 100=0,20700, 500=0,17200, 1000=0,12900, 3000=0,11700, 9000=0,10300, 10000=0,10300, 24000=0,09700 (USD); Mount: Surface Mount; Case/Package: SOT-23-6; Number of Pins: 6; Weight: 0.000529oz; Min Operating Temperature: -40°C; Max Operating Temperature: 85°C; Package Quantity: 3000; Packaging: Tape and Reel; Max Input Voltage: 9V; Number of Channels: 1; Lead Free: Lead Free; RoHS Compliant: Yes; ComponentLink1URL: https://datasheet.ciiva.com/29602/ap3032-29602682.pdf?src-supplier=Digi-Key; ComponentLink1Description: https://datasheet.ciiva.com/29602/ap3032-29602682.pdf?src-supplier=Digi-Key; ComponentLink2URL: https://datasheet.ciiva.com/29603/ap3032-29603101.pdf?src-supplier=Digi-Key; ComponentLink2Description: https://datasheet.ciiva.com/29603/ap3032-29603101.pdf?src-supplier=Digi-Key; ComponentLink3URL: https://datasheet.ciiva.com/29603/ap3032-29603100.pdf?src-supplier=Digi-Key; ComponentLink3Description: https://datasheet.ciiva.com/29603/ap3032-29603100.pdf?src-supplier=Digi-Key; Supplier Part Number 1: 621-AP3032KTR-G1